# EAGLE design SulaMatikV1 (EAGLE 6.4)
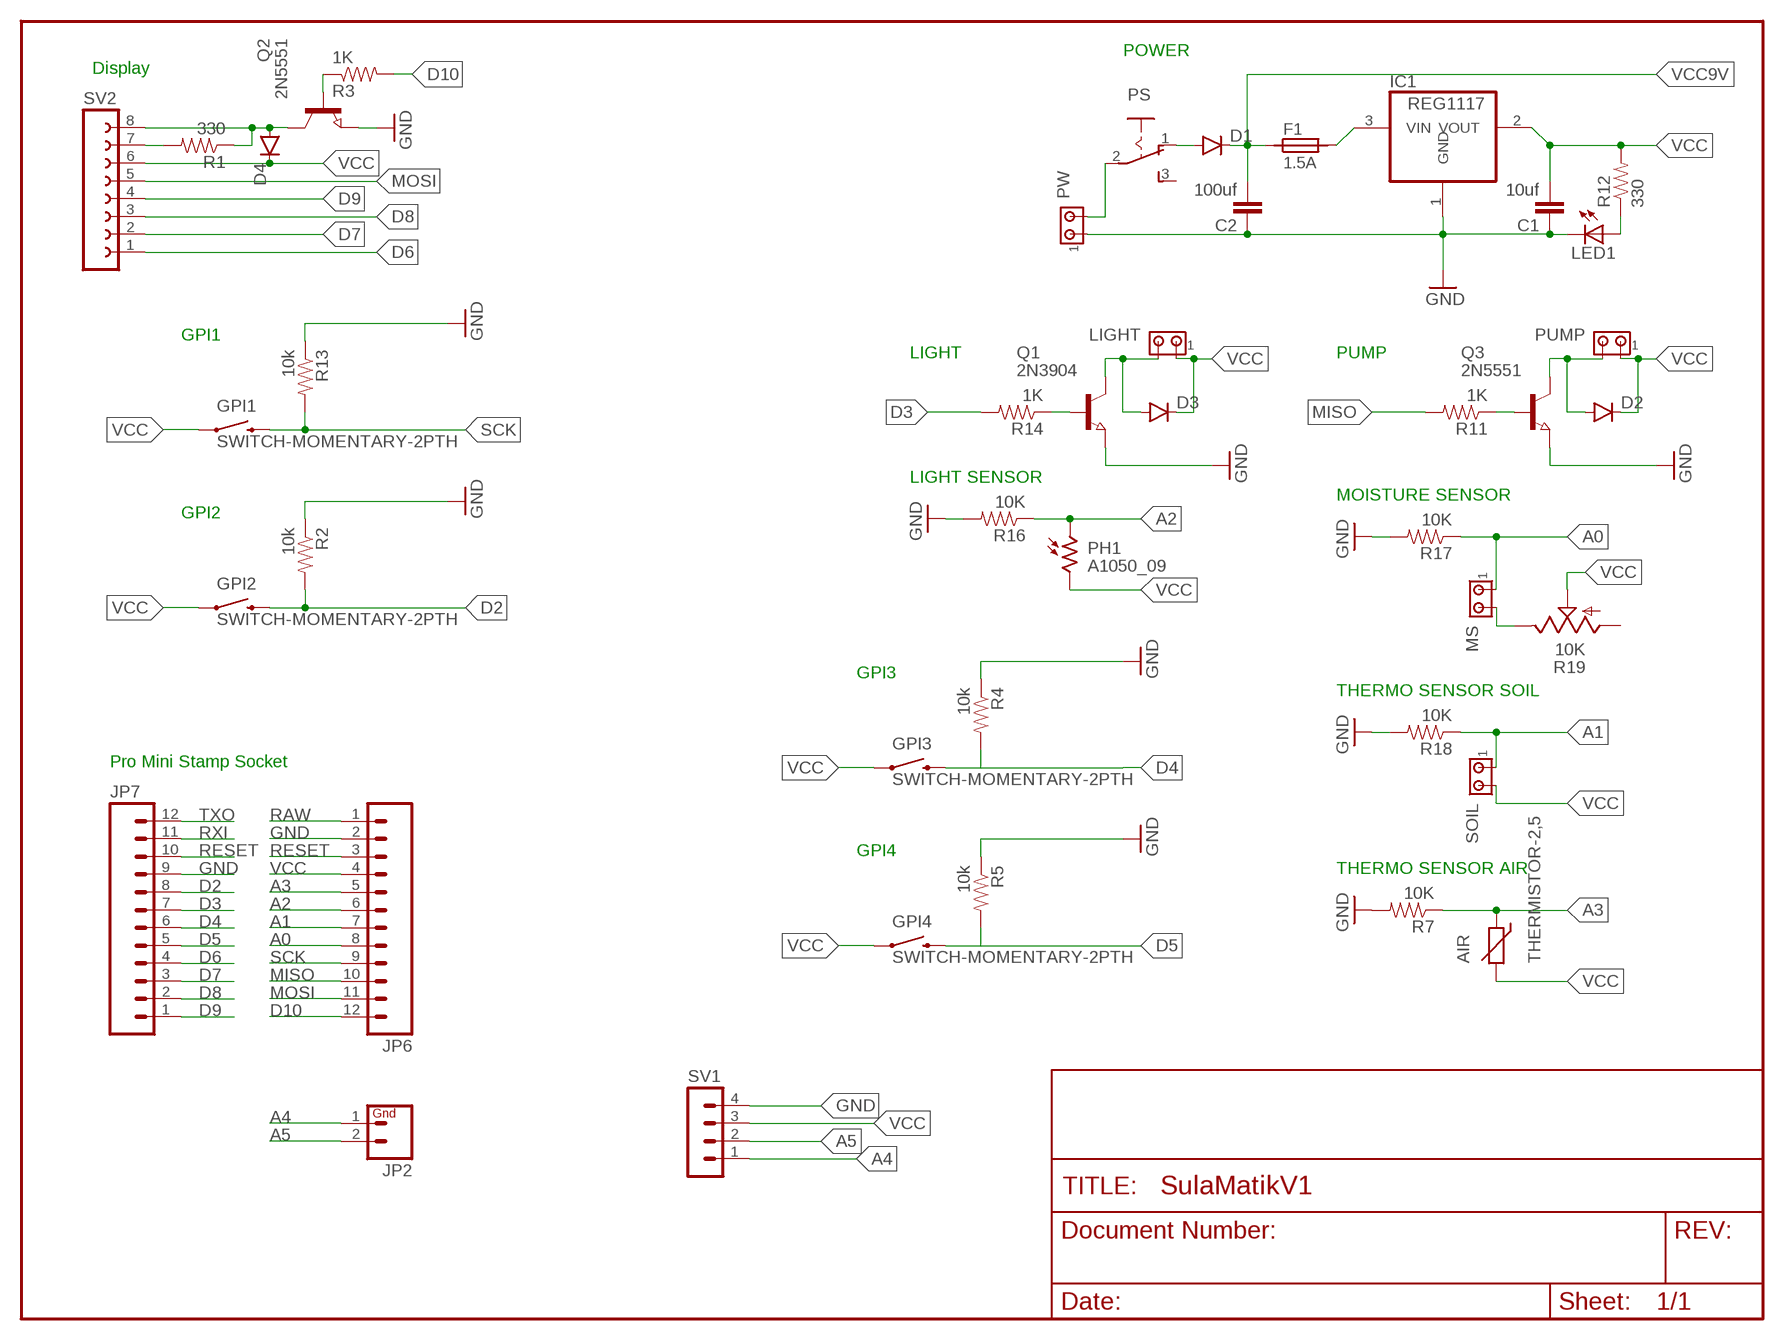
[diagram p0: schematic, sheet 1]

## Parts
AIR  THERMISTOR-2,5  [RS-2,5]
C1  10uf  CAP0805  [0805]
C2  100uf  CAP0805  [0805]
D1  DIODESMA  [SMA-DIODE]
D2  DIODESMA  [SMA-DIODE]
D3  DIODESMA  [SMA-DIODE]
D4  DIODESMA  [SMA-DIODE]
F1  1.5A  SIBA194600  [1820]
GPI1  SWITCH-MOMENTARY-2PTH  [TACTILE-PTH]
GPI2  SWITCH-MOMENTARY-2PTH  [TACTILE-PTH]
GPI3  SWITCH-MOMENTARY-2PTH  [TACTILE-PTH]
GPI4  SWITCH-MOMENTARY-2PTH  [TACTILE-PTH]
IC1  REG1117  [SOT223]
JP2  M02PTH  [1X02]
JP6  M12PTH  [1X12]
JP7  M12PTH  [1X12]
LED1  LEDCHIP-LED0805  [CHIP-LED0805]
LIGHT  MTA02-100  [10X02MTA]
MS  MTA02-100  [10X02MTA]
PH1  A1050_09  [T0-46-A10XX]
PS  255SB  [255SB]
PUMP  MTA02-100  [10X02MTA]
PW  MTA02-100  [10X02MTA]
Q1  2N3904  NPN-TRANSISTOR_SOT23  [SOT23]
Q2  2N5551  NPN-TRANSISTOR_SOT23  [SOT23]
Q3  2N5551  NPN-TRANSISTOR_SOT23  [SOT23]
R1  330  RESISTOR0805-RES  [0805]
R2  10k  RESISTOR0805-RES  [0805]
R3  1K  RESISTOR0805-RES  [0805]
R4  10k  RESISTOR0805-RES  [0805]
R5  10k  RESISTOR0805-RES  [0805]
R7  10K  RESISTOR0805-RES  [0805]
R11  1K  RESISTOR0805-RES  [0805]
R12  330  RESISTOR0805-RES  [0805]
R13  10k  RESISTOR0805-RES  [0805]
R14  1K  RESISTOR0805-RES  [0805]
R16  10K  RESISTOR0805-RES  [0805]
R17  10K  RESISTOR0805-RES  [0805]
R18  10K  RESISTOR0805-RES  [0805]
R19  10K  TRIM_US-CA6V  [CA6V]
SOIL  MTA02-100  [10X02MTA]
SV1  MA04-1  [MA04-1]
SV2  FE08-1  [FE08]

## Nets
A0: JP6.8 MS.1 R17.1
A1: JP6.7 R18.1 SOIL.1
A2: JP6.6 PH1.1 R16.1
A3: AIR.1 JP6.5 R7.1
A4: JP2.1 SV1.1
A5: JP2.2 SV1.2
D2: GPI2.3 JP7.8 R2.2
D3: JP7.7 R14.2
D4: GPI3.3 JP7.6 R4.2
D5: GPI4.3 JP7.5 R5.2
D6: JP7.4 SV2.1
D7: JP7.3 SV2.2
D8: JP7.2 SV2.3
D9: JP7.1 SV2.4
D10: JP6.12 R3.2
GND: C1.1 C2.1 IC1.1(GND) JP6.2 JP7.9 LED1.C PW.1 Q1.2(E) Q2.2(E) Q3.2(E) R2.1 R4.1 R5.1 R7.2 R13.1 R16.2 R17.2 R18.2 SV1.4
MISO: JP6.10 R11.2
MOSI: JP6.11 SV2.5
N$1: F1.2 IC1.3(VIN)
N$2: PS.2(P) PW.2
N$3: R1.2 SV2.7
N$5: D2.A PUMP.2 Q3.3(C)
N$6: Q3.1(B) R11.1
N$7: Q2.1(B) R3.1
N$10: D4.A Q2.3(C) R1.1 SV2.8
N$11: LED1.A R12.1
N$13: D1.A PS.1(O)
N$17: MS.2 R19.E
N$19: D3.A LIGHT.2 Q1.3(C)
N$20: Q1.1(B) R14.1
RAW [v]: JP6.1
RESET: JP6.3 JP7.10
RXI: JP7.11
SCK: GPI1.3 JP6.9 R13.2
TXO: JP7.12
VCC: AIR.2 C1.2 D2.C D3.C D4.C GPI1.1 GPI2.1 GPI3.1 GPI4.1 IC1.2(VOUT) JP6.4 LIGHT.1 PH1.2 PUMP.1 R12.2 R19.S SOIL.2 SV1.3 SV2.6
VCC9V: C2.2 D1.C F1.1
Unconnected: PS.3(S) R19.A

## Notes on the sheet
- POWER
- Display
- GPI1
- LIGHT | PUMP
- LIGHT SENSOR
- MOISTURE SENSOR
- GPI2
- GPI3
- THERMO SENSOR SOIL
- Pro Mini Stamp Socket
- GPI4
- THERMO SENSOR AIR

## Library data of the parts
AIR = varistor:THERMISTOR: THERMISTOR
C1 C2 = SparkFun-Capacitors:CAP: Capacitor Standard 0603 ceramic capacitor, and 0.1" leaded capacitor.
D1-D4 = SparkFun-DiscreteSemi:DIODE: Diode These are standard reverse protection diodes and small signal diodes. SMA package can handle up to about 1A. SOD-323 can handle about 200mA. What the SOD-323 package when ordering, there are some mfgs out there that are 5-pin packages.
F1 = _hhn_PtcFuses_Siba_r500_Ozan:SIBA194600*: SIBA PTC-Fuses, Series 194600, 1812 (4.5 3.2)mm Source: www.siba.de/ Package: SMD 1812 (4.5 x 3.2)mm Technologies: SIBA194600Axxx xxx: Trip-Current * 10 mA Author: Dipl.-Ing. FH Rainer Bayer
GPI1-GPI4 = SparkFun-Electromechanical:SWITCH-MOMENTARY-2: Various NO switches- pushbuttons, reed, etc
IC1 = burr-brown:REG1117: 800mA and 1A Low Dropout (LDO) Positive Regulator 1.8V, 2.5V, 2.85V, 3.3V, 5V, and Adj; MPN: REG1117; OC_FARNELL: 1097566; OC_NEWARK: 14P6981
JP2 = SparkFun:M02: Header 2 Standard 2-pin 0.1" header. Use with straight break away headers (SKU : PRT-00116), right angle break away headers (PRT-00553), swiss pins (PRT-00743), machine pins (PRT-00117), and female headers (PRT-00115). Molex polarized connector foot print use with SKU : PRT-08233 with associated crimp pins and housings.
JP6 JP7 = SparkFun:M12: Header 12 Standard 12-pin 0.1" header. Use with straight break away headers (SKU : PRT-00116), right angle break away headers (PRT-00553), swiss pins (PRT-00743), machine pins (PRT-00117), and female headers (PRT-00115).
LED1 = led:LED: LED OSRAM: - CHIPLED LG R971, LG N971, LY N971, LG Q971, LY Q971, LO R971, LY R971 LH N974, LH R974 LS Q976, LO Q976, LY Q976 LO Q996 - Hyper CHIPLED LW Q18S LB Q993, LB Q99A, LB R99A - SideLED LS A670, LO A670, LY A670, LG A670, LP A670 LB A673, LV A673, LT A673, LW A673 LH A674 LY A675 LS A676, LA A676, LO A676, LY A676, LW A676 LS A679, LY A679, LG A679 - Hyper Micro SIDELED® LS Y876, LA Y876, LO Y876, LY Y876 LT Y87S - SmartLED LW L88C, LW L88S LB L89C, LB L89S, LG L890 LS L89K, LO L89K, LY L89K LS L896, LA L896, LO L896, LY L896 - TOPLED LS T670, LO T670, LY T670, LG T670, LP T670 LSG T670, LSP T670, LSY T670, LOP T670, LYG T670 LG T671, LOG T671, LSG T671 LB T673, LV T673, LT T673, LW T673 LH T674 LS T676, LA T676, LO T676, LY T676, LB T676, LH T676, LSB T676, LW T676 LB T67C, LV T67C, LT T67C, LS T67K, LO T67K, LY T67K, LW E67C LS E67B, LA E67B, LO E67B, LY E67B, LB E67C, LV E67C, LT E67C LW T67C LS T679, LY T679, LG T679 LS T770, LO T770, LY T770, LG T770, LP T770 LB T773, LV T773, LT T773, LW T773 LH T774 LS E675, LA E675, LY E675, LS T675 LS T776, LA T776, LO T776, LY T776, LB T776 LHGB T686 LT T68C, LB T68C - Hyper Mini TOPLED® LB M676 - Mini TOPLED Santana® LG M470 LS M47K, LO M47K, LY M47K Source: http://www.osram.convergy.de LUXEON: - LUMILED® LXK2-PW12-R00, LXK2-PW12-S00, LXK2-PW14-U00, LXK2-PW14-V00 LXK2-PM12-R00, LXK2-PM12-S00, LXK2-PM14-U00 LXK2-PE12-Q00, LXK2-PE12-R00, LXK2-PE12-S00, LXK2-PE14-T00, LXK2-PE14-U00 LXK2-PB12-K00, LXK2-PB12-L00, LXK2-PB12-M00, LXK2-PB14-N00, LXK2-PB14-P00, LXK2-PB14-Q00 LXK2-PR12-L00, LXK2-PR12-M00, LXK2-PR14-Q00, LXK2-PR14-R00 LXK2-PD12-Q00, LXK2-PD12-R00, LXK2-PD12-S00 LXK2-PH12-R00, LXK2-PH12-S00 LXK2-PL12-P00, LXK2-PL12-Q00, LXK2-PL12-R00 Source: www.luxeon.com KINGBRIGHT: KA-3528ASYC Source: www.kingbright.com
LIGHT MS PUMP PW SOIL = con-amp:MTA02-100: AMP connector
PH1 = photo-elements:A10: Sensor Robust Light Sensing Applications Outdoor Light Sensing Application Source: http://optoelectronics.perkinelmer.com/content/Datasheets/DTS_PhotocellsA1050.pdf
PS = switch:255SB: SLIDING SWITCH Distributor Buerklin, 11G810
Q1-Q3 = semicon-smd-ipc:NPN-TRANSISTOR_: NPN TRANSISTOR
R1-R5 R7 R11-R14 R16-R18 = SparkFun-Passives:RESISTOR: Resistor Basic schematic elements and footprints for 0603, 1206, and PTH resistors.
R19 = pot:TRIM_US-: POTENTIOMETER
SV1 = con-lstb:MA04-1: PIN HEADER; OC_FARNELL: unknown; OC_NEWARK: unknown
SV2 = con-lsta:FE08-1: FEMALE HEADER; OC_FARNELL: unknown; OC_NEWARK: unknown

## Net classes
0 default: width 0.3 mm, drill 0.5 mm, clearance 0.25 mm

## Board
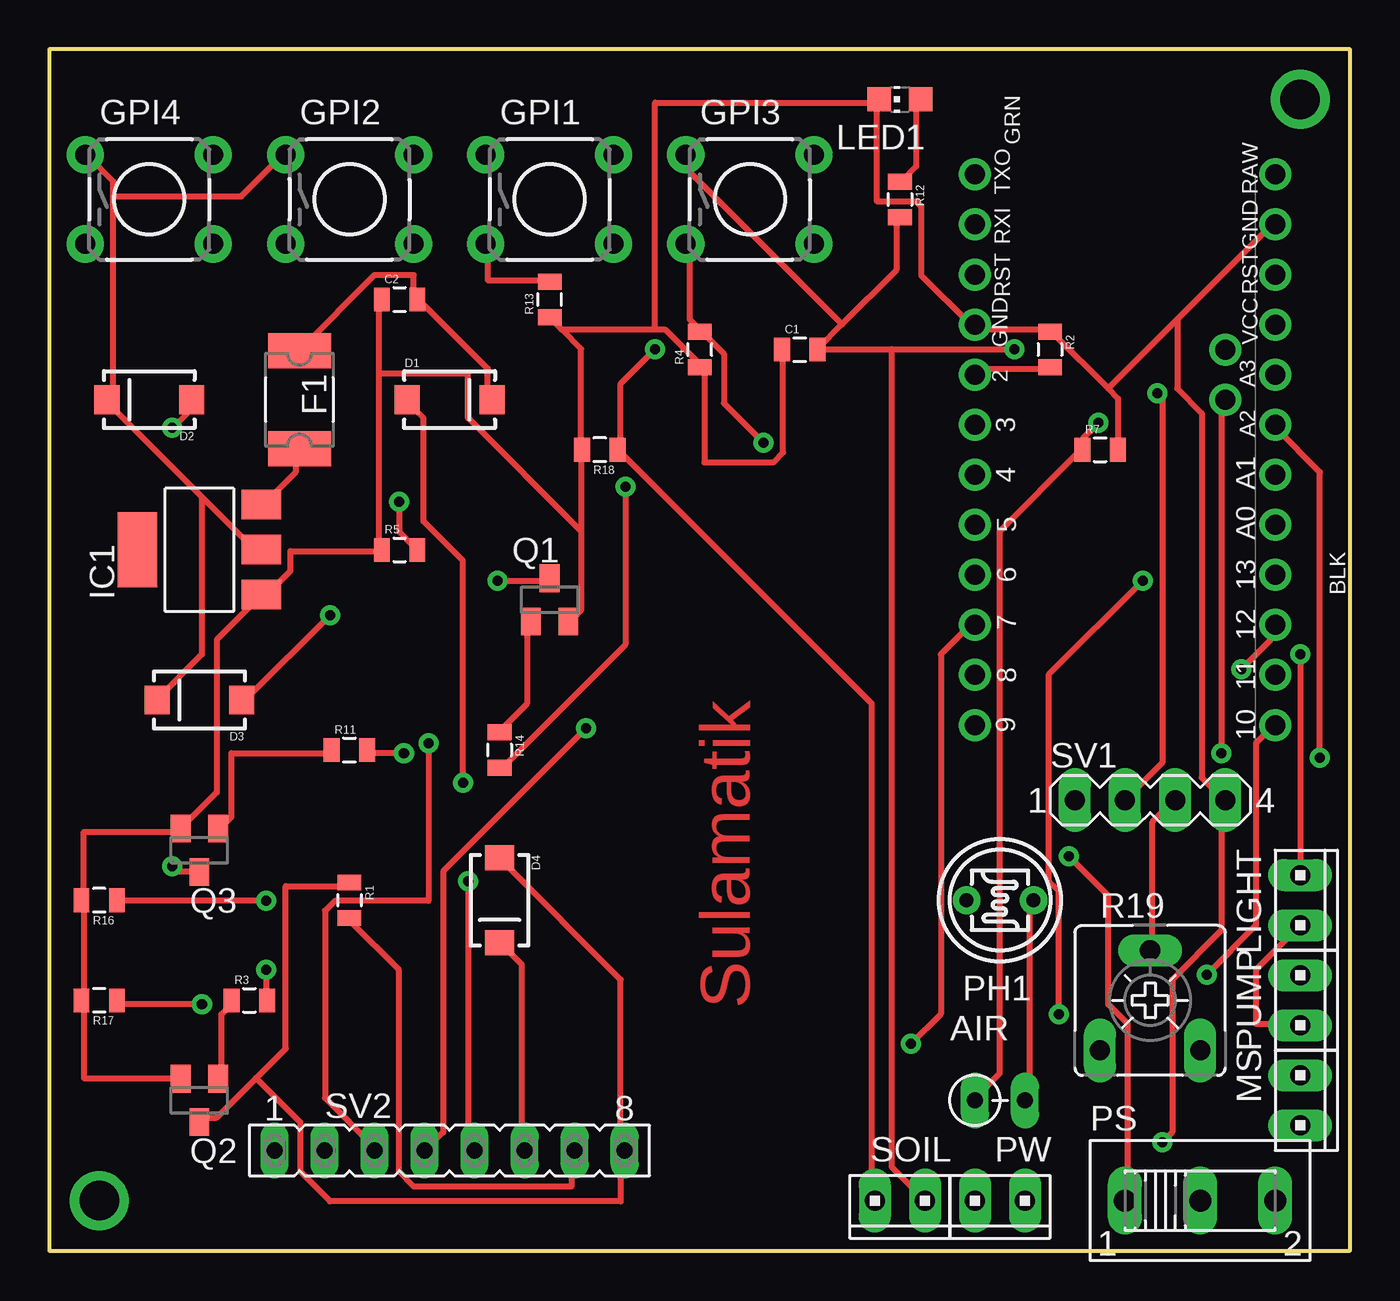
[diagram p1: board, top side]
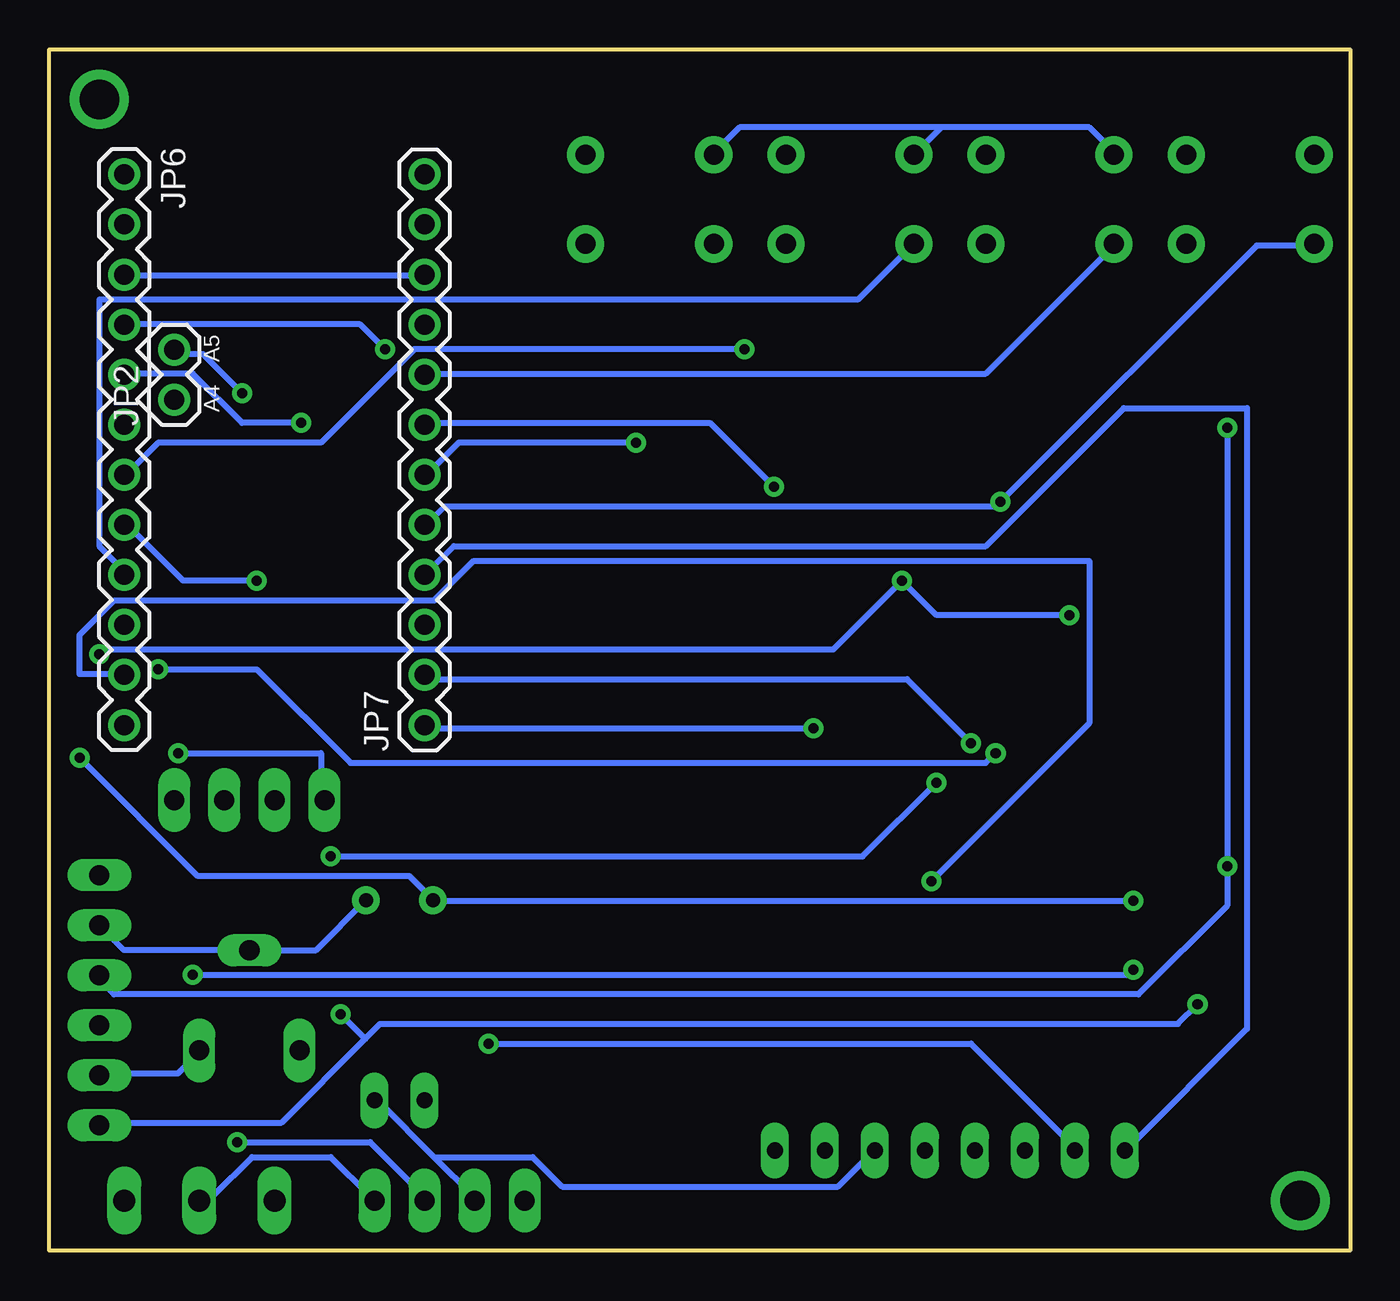
[diagram p2: board, bottom side, seen from below]

Size 66.04 x 60.96 mm. Coordinates in mm from the lower left corner, seen from the top.
Outline: 0,60.96 0,0 66.04,0 66.04,60.96 0,60.96
Copper layers (1*16): Top 0.035mm / dielectric 1.5mm / Bottom 0.035mm
Design rules "SparkFun *": minimum track width 8mil, minimum drill 20mil, track to track 8mil, track to pad 8mil, pad to pad 8mil, via to via 8mil, smd to smd 8mil, copper to edge 10mil, drill to drill 8mil, minimum pad ring 12mil, minimum via ring 10mil, stop-mask expansion 4mil, vias tented up to drill 20mil, thermal gap 10mil

### Footprints (pad centres in the part's own frame; a part is rotated, then mirrored left to right if it is on the bottom)
RS-2,5 = drill 0.813 long: 1 -1.27,0; 2 1.27,0
0805 = smd 0.8 x 1.2: 1 -0.9,0; 2 0.9,0
SMA-DIODE = smd 1.27 x 1.47: A -2.15,0; C 2.15,0
1820 = smd 1.78 x 3.2: 1 -2.49,0; 2 2.49,0
TACTILE-PTH = drill 1.016 pad 1.88: 1 -3.251,2.261; 2 3.251,2.261; 3 -3.251,-2.261; 4 3.251,-2.261
SOT223 = smd 1.499 x 2.007: 1 -2.261,-3.15; 2 0.025,-3.15; 3 2.311,-3.15 | smd 3.81 x 2.007: 4 0,3.15
1X02 = drill 1.016: 1 0,0; 2 2.54,0
1X12 = drill 1.016: 1 0,0; 2 2.54,0; 3 5.08,0; 4 7.62,0; 5 10.16,0; 6 12.7,0; 7 15.24,0; 8 17.78,0; 9 20.32,0; 10 22.86,0; 11 25.4,0; 12 27.94,0
CHIP-LED0805 = smd 1.2 x 1.2: A 0,-1.05; C 0,1.05
10X02MTA = drill 1.016 long: 1 1.27,0; 2 -1.27,0
T0-46-A10XX = drill 0.7 pad 1.4: 1 -1.7,0; 2 1.7,0
255SB = drill 1.118 long: 1 -3.81,0; 2 0,0; 3 3.81,0
SOT23 = smd 1 x 1.4: 1 -0.95,-1.1; 2 0.95,-1.1; 3 0,1.1
CA6V = drill 1.016 long: A -2.54,-2.54; E 2.54,-2.54; S 0,2.54
MA04-1 = drill 1.016 long: 1 -3.81,0; 2 -1.27,0; 3 1.27,0; 4 3.81,0
FE08 = drill 0.813 long: 1 -8.89,0; 2 -6.35,0; 3 -3.81,0; 4 -1.27,0; 5 1.27,0; 6 3.81,0; 7 6.35,0; 8 8.89,0

### Placement (x,y rotation side)
AIR  48.26,7.62 0 top
C1  38.1,45.72 0 top
C2  17.78,48.26 0 top
D1  20.32,43.18 0 top
D2  5.08,43.18 180 top
D3  7.62,27.94 180 top
D4  22.86,17.78 270 top
F1  12.7,43.18 270 top
GPI1  25.4,53.34 0 top
GPI2  15.24,53.34 0 top
GPI3  35.56,53.34 0 top
GPI4  5.08,53.34 0 top
IC1  7.62,35.56 90 top
JP2  59.69,43.18 90 bottom
JP6  62.23,54.61 270 bottom
JP7  46.99,26.67 90 bottom
LED1  43.18,58.42 90 top
LIGHT  63.5,17.78 270 top
MS  63.5,7.62 270 top
PH1  48.26,17.78 0 top
PS  58.42,2.54 0 top
PUMP  63.5,12.7 270 top
PW  48.26,2.54 180 top
Q1  25.4,33.02 0 top
Q2  7.62,7.62 180 top
Q3  7.62,20.32 180 top
R1  15.24,17.78 270 top
R2  50.8,45.72 270 top
R3  10.16,12.7 0 top
R4  33.02,45.72 90 top
R5  17.78,35.56 0 top
R7  53.34,40.64 0 top
R11  15.24,25.4 0 top
R12  43.18,53.34 270 top
R13  25.4,48.26 90 top
R14  22.86,25.4 270 top
R16  2.54,17.78 180 top
R17  2.54,12.7 180 top
R18  27.94,40.64 180 top
R19  55.88,12.7 0 top
SOIL  43.18,2.54 180 top
SV1  55.88,22.86 0 top
SV2  20.32,5.08 0 top

### Tracks (layer width: path | path; a pad name or v marks a point on that pad's centre or on a via)
A0  (via drill 0.51)
  Top 0.3: v7.75,12.5 3.5,12.5 R17.1 | v55.5,34 50.75,29.25 50.75,18.75 51.25,18.25 v51.25,12
  Bottom 0.3: v7.75,12.5 8.75,11.5 49.25,11.5 50,10.75 | 50,10.75 54.25,6.5 63.5,6.5 MS.1 | v55.5,34 59.25,34 62,36.75 JP6.8 | 50,10.75 v51.25,12
A1  (via drill 0.51)
  Top 0.3: SOIL.1 41.75,2.75 41.75,27.75 29,40.5 R18.1 29,40.75 29,44 v30.75,45.75
  Bottom 0.3: v30.75,45.75 47.5,45.75 52.25,41 60.5,41 62,39.5 JP6.7
A2  (via drill 0.51)
  Top 0.3: v11,17.75 3.5,17.75 R16.1 | v64.5,25 64.5,39.5 62.25,41.75 JP6.6
  Bottom 0.3: v11,17.75 46.5,17.75 PH1.1 46.75,18 47.75,19 58.5,19 v64.5,25
A3  (via drill 0.51)
  Top 0.3: AIR.1 47,7.75 48.25,9 48.25,36.5 52.25,40.5 R7.1 52.5,40.75 52.5,41.25 v53.25,42
  Bottom 0.3: v53.25,42 56.25,42 58.75,44.5 62,44.5 JP6.5
A4  (via drill 0.51)
  Top 0.3: v59.5,25.25 59.5,43 JP2.1
  Bottom 0.3: v59.5,25.25 52.25,25.25 52.25,23 SV1.1
A5  (via drill 0.51)
  Top 0.3: SV1.2 56.5,24.75 56.5,43.25 v56.25,43.5
  Bottom 0.3: v56.25,43.5 58.25,45.5 59.5,45.5 JP2.2
D2
  Top 0.3: R2.2 50.75,44.75 47,44.75 47,44.5 JP7.8
  Bottom 0.3: GPI2.3 12,51 18.5,44.5 46.75,44.5 JP7.8
D3  (via drill 0.51)
  Top 0.3: v29.25,38.75 29.25,30.75 23,24.5 R14.2
  Bottom 0.3: v29.25,38.75 32.5,42 46.75,42 JP7.7
D4  (via drill 0.51)
  Top 0.3: GPI3.3 32.5,51 32.5,47.25 33,46.75 R4.2 33.25,46.5 34.25,45.5 34.25,43 v36.25,41
  Bottom 0.3: v36.25,41 45.25,41 46.75,39.5 JP7.6
D5  (via drill 0.51)
  Top 0.3: v17.75,38 17.75,36.5 18.5,35.75 R5.2
  Bottom 0.3: GPI4.3 2,51 4.75,51 v17.75,38 18,37.75 46,37.75 46.75,37 JP7.5
D6
  Bottom 0.3: SV2.1 11.25,5.25 5.25,11.25 5.25,42.75 11.5,42.75 18.5,35.75 45.5,35.75 46.75,34.5 JP7.4
D7  (via drill 0.51)
  Top 0.3: v43.75,10.5 45.25,12 45.25,30.25 46.75,31.75 JP7.3
  Bottom 0.3: v43.75,10.5 19.25,10.5 14,5.25 SV2.2
D8  (via drill 0.51)
  Top 0.3: v19.25,25.75 19.25,17.75 14.5,17.75 14,17.25 14,7.75 16.5,5.25 SV2.3
  Bottom 0.3: v19.25,25.75 22.5,29 46.75,29 JP7.2
D9  (via drill 0.51)
  Top 0.3: v27.25,26.5 20,19.25 20,6 19.25,5.25 SV2.4
  Bottom 0.3: v27.25,26.5 46.75,26.5 JP7.1
D10  (via drill 0.51)
  Top 0.3: v11,14.25 11,12.75 R3.2 | v58.75,14 61.25,16.5 61.25,25.75 62,26.5 JP6.12
  Bottom 0.3: v11,14.25 11.25,14 v58.75,14
GND  (via drill 0.51)
  Top 0.3: Q2.2 6.5,8.75 1.75,8.75 1.75,12.5 R17.2 1.75,12.75 1.75,17.75 R16.2 1.75,18 1.75,21.25 6.5,21.25 Q3.2 8.5,23.25 8.5,31 10.75,33.25 IC1.1 | IC1.1 11,33.25 12.25,34.5 12.25,35.5 16.75,35.5 R5.1 16.75,35.75 16.75,44.5 | 16.75,44.5 16.75,48.25 C2.1 | 11,33.5 IC1.1 | v56.5,5.5 57,6 57,13.75 59.5,16.25 59.5,22.75 SV1.4 59.5,23 58.5,24 58.5,42.5 57.25,43.75 57.25,47.25 | 53.75,43.75 51,46.5 R2.1 50.75,46.75 47,46.75 JP7.9 46.75,47 44.25,49.5 44.25,53 44,53.25 42,53.25 42,58.25 | 53.75,43.75 54.25,43.25 54.25,40.75 R7.2 | 53.75,43.75 57.25,47.25 | 57.25,47.25 62,52 JP6.2 | 26,46.75 27,45.75 27,40.75 R18.2 27,40.5 27,36.5 | 26,46.75 25.5,47.25 R13.1 | 26,46.75 30.75,46.75 | 30.75,46.75 31.25,46.75 33,45 R4.1 33.25,44.75 33.25,40 36.75,40 37.25,40.5 37.25,45.5 C1.1 | 42,58.25 30.75,58.25 30.75,46.75 | 27,36.5 27,32.5 26.5,32 Q1.2 | 42,58.25 LED1.C | 16.75,44.5 21.25,44.5 21.25,42.25 27,36.5
  Bottom 0.3: v56.5,5.5 49.75,5.5 47,2.75 PW.1
MISO  (via drill 0.51)
  Top 0.3: v18,25.25 16.25,25.25 R11.2 | v60.5,29.5 62,31 62,31.75 JP6.10
  Bottom 0.3: v18,25.25 18.5,24.75 50.75,24.75 55.5,29.5 v60.5,29.5
MOSI  (via drill 0.51)
  Top 0.3: v21.25,18.75 21.25,5.5 21.5,5.25 SV2.5
  Bottom 0.3: v21.25,18.75 13.25,26.75 13.25,35 44.5,35 46.5,33 62.75,33 64.5,31.25 64.5,29.25 62.25,29.25 JP6.11
N$1
  Top 0.3: IC1.3 11,38 12.5,39.5 12.5,40.5 F1.2
N$2
  Bottom 0.3: PW.2 49.75,2.75 51.75,4.75 55.75,4.75 57.75,2.75 58.25,2.75 PS.2
N$3
  Top 0.3: R1.2 15.25,16.75 17.75,14.25 17.75,4 18.5,3.25 26.5,3.25 26.5,5 SV2.7
N$4  (via drill 2)
  other vias: 2.54,2.54
N$5  (via drill 0.51)
  Top 0.3: v6.25,19.5 6.25,19.25 7.5,19.25 Q3.3 | v6.25,41.75 7,42.5 7,43 D2.A
  Bottom 0.3: v6.25,41.75 v6.25,19.5 6.25,17.5 10.75,13 62.75,13 63.5,13.75 PUMP.2
N$6
  Top 0.3: R11.1 14.25,25.25 9.25,25.25 9.25,22 8.75,21.5 Q3.1
N$7
  Top 0.3: R3.1 9.25,12.5 8.75,12 8.75,8.75 Q2.1
N$9  (via drill 2)
  other vias: 63.5,58.42
N$10
  Top 0.3: 10.5,8.75 8.5,6.75 7.75,6.75 Q2.3 | 10.5,8.75 12,10.25 12,18.5 15,18.5 R1.1 | D4.A 23,19.75 29,13.75 29,5.25 SV2.8 29,5 29,2.5 14.25,2.5 12.75,4 12.75,6.5 10.5,8.75
N$11
  Top 0.3: R12.1 43.25,54.25 44,55 44,58.25 LED1.A
N$13  (via drill 0.51)
  Top 0.3: v21,23.75 21,35 19,37 19,42.25 18.25,43 D1.A | v51.75,20 53.75,18 53.75,12.5 54.75,11.5 54.75,2.75 PS.1
  Bottom 0.3: v21,23.75 24.75,20 v51.75,20
N$17
  Bottom 0.3: R19.E 58.5,10 59.5,9 63.5,9 MS.2
N$19  (via drill 0.51)
  Top 0.3: v22.75,34 25.25,34 Q1.3 | v14.25,32.25 10,28 D3.A | v63.5,30.25 LIGHT.2
  Bottom 0.3: v14.25,32.25 21,32.25 v22.75,34 26.25,30.5 63.25,30.5 v63.5,30.25
N$20
  Top 0.3: R14.1 23,26.5 24.25,27.75 24.25,31.75 Q1.1
RESET
  Bottom 0.3: JP7.10 47,49.5 62,49.5 JP6.3
SCK
  Top 0.3: R13.2 25.25,49.25 22.25,49.25 22.25,51 GPI1.3
  Bottom 0.3: JP6.9 62.25,34.5 63.5,35.75 63.5,48.25 25,48.25 22.25,51 GPI1.3
VCC  (via drill 0.51)
  Top 0.3: D4.C 23,15.5 24,14.5 24,5.25 SV2.6 | PUMP.1 63.5,11.5 61.25,11.5 61.25,14.25 LIGHT.1 | AIR.2 49.75,7.75 49.75,17.75 PH1.2 | SV1.3 57,22.75 56,21.75 56,15.25 R19.S | 40.25,47 43,49.75 43,52.25 R12.2 | 40.25,47 39,45.75 | 39,45.75 42.75,45.75 | 42.75,45.75 v49,45.75 | 39,45.75 C1.2 | 7.75,38.25 10.25,35.75 10.75,35.75 IC1.2 | 7.75,38.25 3.25,42.75 | 3.25,42.75 3,43 D2.C 3.25,42.75 | 7.75,38.25 7.75,30.25 5.5,28 D3.C | 3.25,42.75 3.25,53.5 | 3.25,53.5 3.25,54.25 2,55.5 GPI4.1 | 3.25,53.5 9.75,53.5 11.75,55.5 GPI2.1 | 40.25,47 32.5,54.75 32.5,55.5 GPI3.1 | 42.75,45.75 42.75,4.25 44.25,2.75 SOIL.2
  Bottom 0.3: PH1.2 50,17.75 52.5,15.25 55.75,15.25 R19.S 56,15.25 62.25,15.25 LIGHT.1 | 46.5,4.75 49.25,7.5 49.5,7.5 AIR.2 | 46.5,4.75 44.5,2.75 SOIL.2 | 46.5,4.75 41.5,4.75 40,3.25 26,3.25 24.25,5 SV2.6 | v49,45.75 50.25,47 62,47 JP6.4 | 20.75,57 22,55.75 GPI1.1 | 20.75,57 13.25,57 12,55.75 GPI2.1 | 20.75,57 31,57 32.25,55.75 GPI3.1
VCC9V
  Top 0.3: D1.C 22.25,43.25 22.25,44.75 18.75,48.25 C2.2 18.5,48.5 18.5,49.5 16.5,49.5 12.75,45.75 F1.1

### Text on the board
Top: Sulamatik
tPlace: GRN | TXO | RAW | RXI | GND | RST | RST | VCC | GND | 2 | A3 | 3 | A2 | 4 | A1 | 5 | A0 | 6 | 13 | BLK | 7 | 12 | 8 | 11 | 9 | 10
bPlace: A5 | A4